# Altium schematic sheet Copy of HV_PWR_STAGE.SchDoc: Stabilizer
size 420 x 297 mm; EDA_Number: ARTIQ; Projet: Sampler; Author: G.Kasprowicz; CompanyName: WUT ISE; DrawnBy: G.Kasprowicz; Organization: WUT ISE; Address1: PW ISE; Address2: Nowowiejska 15/19 00-665 Warsaw; Address3: gkasprow@gmail.com; DocumentNumber: 8; Revision: 1.0; SheetNumber: 8; SheetTotal: 11; ModifiedBy: -; CheckedDate: -; Title2: ADC; DivGrp: WUT ISE; Designer: G.Kasprowicz; ModifiedDate: -; ProjectName: Sensor Box
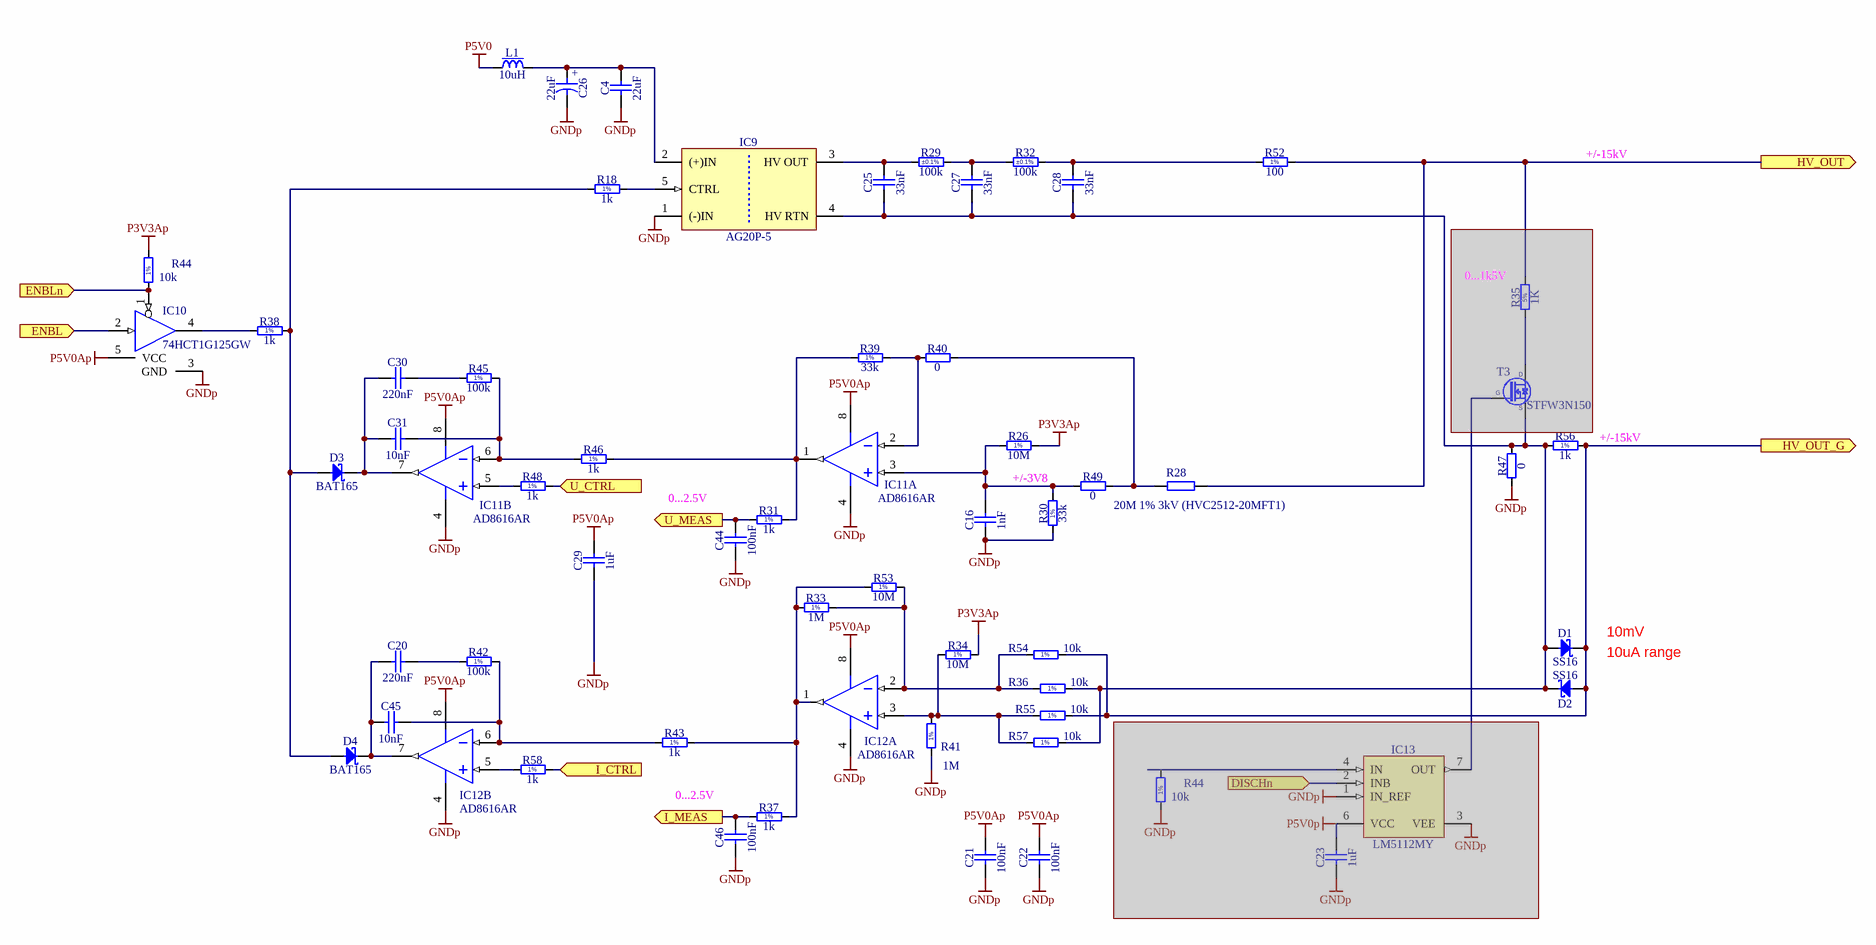
[diagram p0: Copy of HV_PWR_STAGE.SchDoc]

## Parts
(Parts that share a designator on the sheet are numbered #1, #2 ... from top to bottom, then left to right.)
C4  22uF  [CAPC3216X180N]
C16  1nF  [CAPC1005X55N]
C20  220nF  [CAPC1608X87N]
C21  100nF  [CAPC1005X55N]
C22  100nF  [CAPC1005X55N]
C23  1uF  [CAPC1608X87N]  (masked out: inside a compile mask, not in the netlist)
C25  33nF  [CAPC5764X279N]
C26  22uF  [CAPMP3528X210N]
C27  33nF  [CAPC5764X279N]
C28  33nF  [CAPC5764X279N]
C29  1uF  [CAPC1608X87N]
C30  220nF  [CAPC1608X87N]
C31  10nF  [CAPC1608X87N]
C44  100nF  [CAPC1005X55N]
C45  10nF  [CAPC1608X87N]
C46  100nF  [CAPC1005X55N]
D1  SS16  [DIOM5127X229N]
D2  SS16  [DIOM5127X229N]
D3  BAT165  [SOD2512X110N]
D4  BAT165  [SOD2512X110N]
IC9  AG20P-5  [DCDC_XPPOWER_AG0-2KV]
IC10  74HCT1G125GW  [SOT65P210X110-5N]
IC11  AD8616AR  [ADI-R-8_N]  (parts A,B of 2)
IC12  AD8616AR  [ADI-R-8_N]  (parts A,B of 2)
IC13  LM5112MY  [SOP65P490X110-9N-R190X200]  (masked out: inside a compile mask, not in the netlist)
L1  10uH  [IND_BOURNS_PM43]
R18  1k  [RESC1608X55N]
R26  10M  [RESC1508X63N]
R28  20M 1% 3kV (HVC2512-20MFT1)  [2512]
R29  100k  Tolerance: ±0.1%  [RESC3216X50N]
R30  33k  [RESC1005X40N]
R31  1k  [RESC1005X40N]
R32  100k  Tolerance: ±0.1%  [RESC3216X50N]
R33  1M  [RESC1005X40N]
R34  10M  [RESC1508X63N]
R35  1K  [RES_OHMITE_MC102]  (masked out: inside a compile mask, not in the netlist)
R36  10k  [RESC1005X40N]
R37  1k  [RESC1005X40N]
R38  1k  [RESC1005X40N]
R39  33k  [RESC1005X40N]
R40  0  [RESC1005X40N]
R41  1M  [RESC1005X40N]
R42  100k  [RESC1608X55N]
R43  1k  [RESC1005X40N]
R44#1  10k  [RESC1005X40N]
R44#2  10k  [RESC1005X40N]  (masked out: inside a compile mask, not in the netlist)
R45  100k  [RESC1608X55N]
R46  1k  [RESC1005X40N]
R47  0  [RESC1005X40N]
R48  1k  [RESC1005X40N]
R49  0  [RESC1005X40N]
R52  100  [RESC6331X70N]
R53  10M  [RESC1508X63N]
R54  10k  [RESC1005X40N]
R55  10k  [RESC1005X40N]
R56  1k  [RESC1005X40N]
R57  10k  [RESC1005X40N]
R58  1k  [RESC1005X40N]
T3  STFW3N150  [INFINEON_PG-TO-220 FP-h]  (masked out: inside a compile mask, not in the netlist)

## Ports
DISCHn (in), ENBL (in), ENBLn (in), HV_OUT (out), HV_OUT_G (out), I_CTRL (in), I_MEAS (out), U_CTRL (in), U_MEAS (out)

## Nets
GNDp: C4.1 C16.1 C21.1 C22.1 C26.2 C29.1 C44.1 C46.1 IC9.1((-)IN) IC10.3(GND) IC11.4(-V) IC12.4(-V) R30.1 R41.1 R47.1
P3V3Ap: R26.2 R34.2 R44#1.2
P5V0: L1.1
P5V0Ap: C21.2 C22.2 C29.2 IC10.5(VCC) IC11.8(+V) IC12.8(+V)
ENBL: IC10.2(IN) ; port ENBL
ENBLn: IC10.1(~{G}) R44#1.1 ; port ENBLn
HV_OUT: R28.2 R52.2 ; port HV_OUT
HV_OUT_G: D1.1(C) D2.2(A) R54.2 R55.2 R56.2 ; port HV_OUT_G
I_CTRL: R58.2 ; port I_CTRL
I_MEAS: C46.2 R37.1 ; port I_MEAS
U_CTRL: R48.2 ; port U_CTRL
U_MEAS: C44.2 R31.1 ; port U_MEAS
NetC4_2: C4.2 C26.1 IC9.2((+)IN) L1.2
NetC16_2: C16.2 IC11.3(+IN_A) R26.1 R30.2 R49.1
NetC20_1: C20.1 C45.1 D4.1(C) IC12.7(OUT_B)
NetC20_2: C20.2 R42.1
NetC25_1: C25.1 C27.1 C28.1 D1.2(A) D2.1(C) IC9.4(HV_RTN) R36.2 R47.2 R56.1 R57.2
NetC25_2: C25.2 IC9.3(HV_OUT) R29.1
NetC27_2: C27.2 R29.2 R32.1
NetC28_2: C28.2 R32.2 R52.1
NetC30_1: C30.1 C31.1 D3.1(C) IC11.7(OUT_B)
NetC30_2: C30.2 R45.1
NetC31_2: C31.2 IC11.6(-IN_B) R45.2 R46.1
NetC45_2: C45.2 IC12.6(-IN_B) R42.2 R43.1
NetD3_2: D3.2(A) D4.2(A) R18.1 R38.2
NetIC9_5: IC9.5(CTRL) R18.2
NetIC10_4: IC10.4(OUT) R38.1
NetIC11_1: IC11.1(OUT_A) R31.2 R39.1 R46.2
NetIC11_2: IC11.2(-IN_A) R39.2 R40.1
NetIC11_5: IC11.5(+IN_B) R48.1
NetIC12_1: IC12.1(OUT_A) R33.1 R37.2 R43.2 R53.1
NetIC12_2: IC12.2(-IN_A) R33.2 R36.1 R53.2 R54.1
NetIC12_3: IC12.3(+IN_A) R34.1 R41.2 R55.1 R57.1
NetIC12_5: IC12.5(+IN_B) R58.1
NetR28_1: R28.1 R40.2 R49.2

## Notes on the sheet
- +/-15kV
- (near R35) 0...1k5V
- +/-3V8
- (near R56) +/-15kV
- 0...2.5V
- 10uA range
- (near D1) 10mV
- Project/Equipment
- Document
- Designer
- Drawn by
- Check.by
- Copyright WUT ISE 2018.
  This documentation describes Open Hardware and is licensed under the CERN OHL v.1.1. You may redistribute and modify this documentation under the terms of the CERN OHL v.1.1. (http://ohwr.org/CERNOHL). This documentation is distributed WITHOUT ANY EXPRESS OR IMPLIED WARRANTY, INCLUDING OF MERCHANTABILITY, SATISFACTORY QUALITY AND FITNESS FOR A PARTICULAR PURPOSE. Please see the CERN OHL v.1.1 for applicable conditions.
- Contact
- File
- Last Mod.
- Print Date
- Sheet
- Size
- A3
- of
- Rev
- (in symbol CTE3528-21_22UF_20V_10%) +
- (in symbol R0402_1K_1%_0.0625W_100PPM) 1%
- (in symbol R0402_1M_1%_0.0625W_100PPM) 1%
- (in symbol R0402_10K_1%_0.0625W_100PPM) 1%
- (in symbol R0402_33K_1%_0.0625W_100PPM) 1%
- (in symbol R0603_1K_1%_0.1W_100PPM) 1%
- (in symbol R0603_10M_1%_0.125W_100PPM_VISHAY_CHP) 1%
- (in symbol R0603_100K_1%_0.1W_100PPM) 1%
- (in symbol R2512_100R_1%_1.5W_100PPM_VISHAY_CRCW-HP e3) 1%
- (in symbol R5025_1K_5%_1W_50PPM_OHMITE_MC102) 5%

## Library data of the parts
C4 = CC1206_22UF_25V_20%_X5R: Non-polarised capacitor; Part Description: SMD Multilayer Chip Ceramic Capacitor; Manufacturer: GENERIC; Manufacturer1 Part Number: C3216X5R1E226M160AB; Voltage: 25V; TC: X5R; Tolerance: ±20%; Part Number: CC1206_22UF_25V_20%_X5R; Component Kind: Standard; Component Type: Standard; Pin Count: 2; Value: 22uF; Status: None; Manufacturer Part Number: CC1206_22UF_25V_20%_X5R; Case: 1206; Mounted: Yes; Socket: No; SMD: Yes; Sense: No; Manufacturer1 Example: TDK; Manufacturer1 ComponentHeight: 1.8mm; HelpURL: \\cern.ch\dfs\Applications\Altium\Datasheets\CC1206_X5R_TDK_C.pdf; Author: CERN DEM WB; CreateDate: 25/07/2018; LatestRevisionDate: 25/07/2018
C16 = CC0402_1NF_50V_10%_X7R: Non-polarised capacitor; Part Description: SMD Multilayer Chip Ceramic Capacitor; Manufacturer: GENERIC; Manufacturer1 Part Number: 223858715623; Voltage: 50V; TC: X7R; Tolerance: ±10%; Part Number: CC0402_1NF_50V_10%_X7R; Component Kind: Standard; Component Type: Standard; Pin Count: 2; Value: 1nF; Status: Not Recommended; Manufacturer Part Number: CC0402_1NF_50V_10%_X7R; Case: 0402; Mounted: Yes; Socket: No; SMD: Yes; Sense: No; Manufacturer1 Example: PHYCOMP; Manufacturer1 ComponentHeight: 0.55mm; HelpURL: \\cern.ch\dfs\Applications\Altium\Datasheets\CC0402_X7R_PHYCOMP.pdf; Author: CERN DEM JLC; CreateDate: 2007-12-03; LatestRevisionDate: 2007-12-03
C20 C30 = CC0603_220NF_10V_10%_X7R: Non-polarised capacitor; Part Description: SMD Multilayer Chip Ceramic Capacitor; Manufacturer: GENERIC; Manufacturer1 Part Number: 223824615654 or CC0603KRX7R6BB224; Voltage: 10V; TC: X7R; Tolerance: ±10%; Part Number: CC0603_220NF_10V_10%_X7R; Component Kind: Standard; Component Type: Standard; Pin Count: 2; Value: 220nF; Status: Preferred; Manufacturer Part Number: CC0603_220NF_10V_10%_X7R; Case: 0603; Mounted: Yes; Socket: No; SMD: Yes; Sense: No; Manufacturer1 Example: YAGEO PHYCOMP; Manufacturer1 ComponentHeight: 0.9mm; HelpURL: \\cern.ch\dfs\Applications\Altium\Datasheets\CC0603_X7R_PHYCOMP.pdf; Author: CERN DEM JLC; CreateDate: 2012-10-25; LatestRevisionDate: 2012-10-25
C21 C22 C44 C46 = CC0402_100NF_16V_10%_X7R: Non-polarised capacitor; Part Description: SMD Multilayer Chip Ceramic Capacitor; Manufacturer: GENERIC; Manufacturer1 Part Number: GRM155R71C104KA88D; Voltage: 16V; TC: X7R; Tolerance: ±10%; Part Number: CC0402_100NF_16V_10%_X7R; Component Kind: Standard; Component Type: Standard; Pin Count: 2; Value: 100nF; Status: Not Recommended; Manufacturer Part Number: CC0402_100NF_16V_10%_X7R; Case: 0402; Mounted: Yes; Socket: No; SMD: Yes; Sense: No; Manufacturer1 Example: MURATA; Manufacturer1 ComponentHeight: 0.55mm; HelpURL: \\cern.ch\dfs\Applications\Altium\Datasheets\CC0402_X7R_MURATA_GRM.pdf; Author: CERN DEM JLC; CreateDate: 2013-12-05; LatestRevisionDate: 2007-12-03
C23 C29 = CC0603_1UF_25V_10%_X7R: Non-polarised capacitor; Part Description: SMD Multilayer Chip Ceramic Capacitor; Manufacturer: GENERIC; Manufacturer1 Part Number: GRM188R71E105KA12D; Voltage: 25V; TC: X7R; Tolerance: ±10%; Part Number: CC0603_1UF_25V_10%_X7R; Component Kind: Standard; Component Type: Standard; Pin Count: 2; Value: 1uF; Status: None; Manufacturer Part Number: CC0603_1UF_25V_10%_X7R; Case: 0603; Mounted: Yes; Socket: No; SMD: Yes; Sense: No; Manufacturer1 Example: MURATA; Manufacturer1 ComponentHeight: 0.9mm; HelpURL: \\cern.ch\dfs\Applications\Altium\Datasheets\CC0603_X7R_MURATA.pdf; Author: CERN DEM JLC
  C23: CreateDate: 2011-01-18; LatestRevisionDate: 2011-01-18
  C29: CreateDate: 18/01/2011; LatestRevisionDate: 18/01/2011
C25 C27 C28 = CC2225_33NF_2KV_10%_X7R: Non-polarised capacitor; Part Description: High Voltage MLC Chip Capacitor; Manufacturer: GENERIC; Manufacturer1 Part Number: 2225GC333KAT1A; Voltage: 2KV; TC: X7R; Tolerance: ±10%; Part Number: CC2225_33NF_2KV_10%_X7R; Component Kind: Standard; Component Type: Standard; Pin Count: 2; Value: 33nF; Status: None; Manufacturer Part Number: CC2225_33NF_2KV_10%_X7R; Case: 2225; Mounted: Yes; Socket: No; SMD: Yes; Sense: No; Manufacturer1 Example: AVX; Manufacturer1 ComponentHeight: 2.54mm; HelpURL: \\cern.ch\dfs\Applications\Altium\Datasheets\CC2225_X7R_AVX_HV-MLC.pdf; Author: CERN DEM JMW; CreateDate: 13.07.2015; LatestRevisionDate: 13.07.2015
C26 = CTE3528-21_22UF_20V_10%: Polarised capacitor; Part Description: Solid Tantalum Chip Capacitor; Manufacturer: GENERIC; Manufacturer1 Part Number: TAJB226K020R; Voltage: 20V; Tolerance: ±10%; Part Number: CTE3528-21_22UF_20V_10%; Component Kind: Standard; Component Type: Standard; Pin Count: 2; Value: 22uF; Status: Preferred; Manufacturer Part Number: CTE3528-21_22UF_20V_10%; Case: B; Mounted: Yes; Socket: No; SMD: Yes; Sense: No; Manufacturer1 Example: AVX; Manufacturer1 ComponentHeight: 2.1mm; HelpURL: \\cern.ch\dfs\Applications\Altium\Datasheets\CTE_AVX_TAJ.pdf; Author: CERN DEM JLC; CreateDate: 03/12/2007; LatestRevisionDate: 03/12/2007
C31 C45 = CC0603_10NF_50V_5%_C0G: Non-polarised capacitor; Part Description: SMD Multilayer Chip Ceramic Capacitor; Manufacturer: GENERIC; Manufacturer1 Part Number: C1608C0G1H103J080AA; Voltage: 50V; TC: C0G/NP0; Tolerance: ±5%; Part Number: CC0603_10NF_50V_5%_C0G; Component Kind: Standard; Component Type: Standard; Pin Count: 2; Value: 10nF; Status: Preferred; Manufacturer Part Number: CC0603_10NF_50V_5%_C0G; Case: 0603; Mounted: Yes; Socket: No; SMD: Yes; Sense: No; Manufacturer1 Example: TDK; Manufacturer1 ComponentHeight: 0.9mm; HelpURL: \\cern.ch\dfs\Applications\Altium\Datasheets\CC0603_C0G_TDK_C.pdf; Author: CERN DEM JLC; CreateDate: 2014-12-10; LatestRevisionDate: 2014-12-10
D1 D2 = SS16: Schottky Diode; Part Description: Surface Mount Schottky Barrier Rectifier; Manufacturer: VISHAY GENERAL SEMICONDUCTOR; Voltage: 60V; Power: 1A; PressFit: No; Bonding: No; Part Number: SS16; Component Kind: Standard; Component Type: Standard; Device: SS16; PackageDescription: DO-214-AC Molded Diode, Body 5.1x2.7mm, IPC Medium Density; Manufacturer Part Number: SS16; Pin Count: 2; Case: DO-214AC; Mounted: Yes; Socket: No; SMD: Yes; Sense: No; ComponentHeight: 2.29mm; HelpURL: \\cern.ch\dfs\Applications\Altium\Datasheets\SS16.pdf; Author: CERN DEM JLC; CreateDate: 2008-07-15; LatestRevisionDate: 2010-08-23
D3 D4 = BAT165: Schottky Diode; Part Description: Medium Power AF Schottky Diode; Manufacturer: INFINEON; Voltage: 40V; Power: 750mA; PressFit: No; Bonding: No; Part Number: BAT165; Component Kind: Standard; Component Type: Standard; Device: BAT165; PackageDescription: Small Outline Diode (SOD-323), 1.70mm W X 1.25mm L X 1.10mm H body,  IPC Medium Density; Manufacturer Part Number: BAT165; Pin Count: 2; Case: SOD-323; Mounted: Yes; Socket: No; SMD: Yes; Sense: No; ComponentHeight: 1.1mm; HelpURL: \\cern.ch\dfs\Applications\Altium\Datasheets\BAT165.pdf; Author: CERN DEM JLC; CreateDate: 12.11.2014; LatestRevisionDate: 12.11.2014
IC9 = AG20P-5: XP POWER, AG Series, DC/HVDC Converter; Part Description: 5VDC to 0-2kVDC, Iout (max) 0.5mA, 1W DC-HVDC Converter; PressFit: No; Bonding: No; Part Number: AG20P-5; Component Kind: Standard; Component Type: Standard; Device: AG20P-5; PackageDescription: AG Series, DC/HVDC Converter, Body W 11.43mm x L 23.37mm x H 6.35mm; Manufacturer: XP POWER; Manufacturer Part Number: AG20P-5; Pin Count: 5; Mounted: Yes; Socket: No; SMD: Yes; Sense: No; ComponentHeight: 3.3mm; HelpURL: \\cern.ch\dfs\Applications\Altium\Datasheets\XPPOWER_AG-Series.pdf; Author: CERN DEM BC; CreateDate: 18.09.2020; LatestRevisionDate: 18.09.2020
IC10 = 74HCT1G125GW: Single Bus Buffer Gate With 3-State Output; Part Description: Bus Buffer/Line Driver 3-State; Manufacturer: NEXPERIA; PressFit: No; Bonding: No; Part Number: 74HCT1G125GW; Component Kind: Standard; Component Type: Standard; Device: 74HCT1G125GW; PackageDescription: SOT353, SC70-5, 0.65mm Pitch; 5 Pin, 1.25mm W X 2.00mm L X 1.10mm H body, IPC Medium Density; Manufacturer Part Number: 74HCT1G125GW; Pin Count: 5; Case: SOT353; Mounted: Yes; Socket: No; SMD: Yes; Sense: No; ComponentHeight: 1.1mm; Author: CERN DEM JMW; HelpURL: \\cern.ch\dfs\Applications\Altium\Datasheets\74HCT1G125GW.pdf; CreateDate: 06.08.2020; LatestRevisionDate: 06.08.2020
IC11 IC12 = CMP-0384-00615-1: Double Channel Wide Bandwidth Operational Amplifier, 24 MHz BW, 12 V/us SR, Industrial, 8-pin SOIC (R-8), Tube; Manufacturer: Analog Devices; Generic Part Number: AD8616; Input Bias Current: 200fA; Amplifiers Per Package: 2; V Span Min: 2.7V; Input Offset Voltage: 23uV; V Span Max: 6V; Small Signal Bandwidth: 24MHz; Slew Rate: 12V/us; Iq/Amp: 2mA; ComponentLink3Description: Package Specification; ComponentLink3URL: http://www.analog.com/static/imported-files/packages/PKG_PDF/SOIC_Narrow%20(R)/R_8.pdf; ComponentLink2URL: http://www.analog.com/static/imported-files/data_sheets/AD8615_8616_8618.pdf; PackageVersion: 060506-A; Mounting Technology: Surface Mount; Code_JEDEC: MS-012-AA; PackageDescription: 8-Pin Standard Small Outline Package, Body 3.9 x 4.9 mm, Pitch 1.27 mm; ComponentLink1Description: Manufacturer URL; PartNumber: AD8616AR; ComponentLink1URL: http://www.analog.com/en/index.html; DatasheetVersion: Rev. E; PackageReference: R-8; ComponentLink2Description: Datasheet
IC13 = LM5112MY: Tiny 7A MOSFET Gate Driver; Manufacturer: NATIONAL SEMICONDUCTOR; PressFit: No; Bonding: No; Part Number: LM5112MY; Component Kind: Standard; Component Type: Standard; Device: LM5112MY; PackageDescription: SOP, 0.65mm Pitch; 8 Pin, 3.00mm W X 3.00mm L X 1.10mm H body (w/Thermal Tab 1.90 X 2.00mm), IPC Medium Density; Part Description: Tiny 7A MOSFET Gate Driver; Manufacturer Part Number: LM5112MY; Pin Count: 8; Case: MSOP8; Mounted: Yes; Socket: No; SMD: Yes; Sense: No; ComponentHeight: 1.1mm; Author: CERN DEM JLC; HelpURL: \\cern.ch\dfs\Applications\Altium\Datasheets\LM5112MY.pdf; CreateDate: 25.11.2008; LatestRevisionDate: 27.03.2019
L1 = IND_10UH_20%_BOURNS_PM43: Inductor With Core; Part Description: SMD Power Inductor; Manufacturer: BOURNS; Manufacturer Part Number: PM43-100M-RC; Power: 1.15A; Resistance: 0.18R; Tolerance: ±20%; Part Number: IND_10UH_20%_BOURNS_PM43; Component Kind: Standard; Component Type: Standard; Pin Count: 2; Value: 10uH; Status: None; Mounted: Yes; Socket: No; SMD: Yes; Sense: No; ComponentHeight: 3.5mm; HelpURL: \\cern.ch\dfs\Applications\Altium\Datasheets\IND_BOURNS_PM43.pdf; Author: CERN DEM JLC; CreateDate: 17/05/2011; LatestRevisionDate: 17/05/2011
R18 = R0603_1K_1%_0.1W_100PPM: Resistor - 1%; Part Description: General Purpose Thick Film Chip Resistor; Manufacturer: GENERIC; Manufacturer1 Part Number: NRC06F1001TRF; Power: 0.1W; TC: ±100ppm/°C; PressFit: No; Part Number: R0603_1K_1%_0.1W_100PPM; Component Kind: Standard; Component Type: Standard; Pin Count: 2; Value: 1k; Status: Preferred; Tolerance: ±1%; Manufacturer Part Number: R0603_1K_1%_0.1W_100PPM; Case: 0603; Mounted: Yes; Sense: No; Socket: No; SMD: Yes; Manufacturer1 Example: NIC COMPONENT; Manufacturer1 ComponentHeight: 0.55mm; HelpURL: \\cern.ch\dfs\Applications\Altium\Datasheets\R0603_NIC_NRC.pdf; Author: CERN DEM JLC; CreateDate: 03/12/2007; LatestRevisionDate: 13/03/2008
R26 R34 R53 = R0603_10M_1%_0.125W_100PPM_VISHAY_CHP: Resistor - 1%; Part Description: High Stability Metal Glaze Thick Film Chip Resistor; Manufacturer: VISHAY SFERNICE; Manufacturer Part Number: CHP0603K1005FNT; Power: 0.125W; TC: ±100ppm/°C; Part Number: R0603_10M_1%_0.125W_100PPM_VISHAY_CHP; Component Kind: Standard; Component Type: Standard; Pin Count: 2; Value: 10M; Status: None; Tolerance: ±1%; Case: 0603; Mounted: Yes; Sense: No; Socket: No; SMD: Yes; ComponentHeight: 0.63mm; HelpURL: \\cern.ch\dfs\Applications\Altium\Datasheets\R0603_VISHAY_CHP.pdf; Author: CERN DEM JLC; CreateDate: 2011-06-22; LatestRevisionDate: 2011-06-22
R28 = RES_SMD_POW: 1W SMD Resistor (TME)
R29 R32 = R1206_100K_0.1%_0.4W_25PPM_VISHAY_PAT: Resistor - 0.1%; Part Description: Precision Automotive Thin Film Chip Resistors 2kV ESD Rating; Manufacturer: VISHAY DALE THIN FILM; Manufacturer Part Number: PAT1206E1003BS; Power: 0.4W; TC: ±25ppm/°C; PressFit: No; Part Number: R1206_100K_0.1%_0.4W_25PPM_VISHAY_PAT; Component Kind: Standard; Component Type: Standard; Pin Count: 2; Value: 100k; Status: None; Case: 1206; Mounted: Yes; Sense: No; Socket: No; SMD: Yes; ComponentHeight: 0.5mm; HelpURL: \\cern.ch\dfs\Applications\Altium\Datasheets\R1206_VISHAY_PAT.pdf; Author: CERN DEM MR; CreateDate: 19.07.2016; LatestRevisionDate: 19.07.2016
R30 R39 = R0402_33K_1%_0.0625W_100PPM: Resistor - 1%; Part Description: General Purpose Thick Film Chip Resistor; Manufacturer: GENERIC; Manufacturer1 Part Number: 232270673303L; TC: ±100ppm/°C; Part Number: R0402_33K_1%_0.0625W_100PPM; Component Kind: Standard; Component Type: Standard; Pin Count: 2; Value: 33k; Status: Not recommended; Power: 0.0625W; Tolerance: ±1%; Manufacturer Part Number: R0402_33K_1%_0.0625W_100PPM; Case: 0402; Mounted: Yes; Sense: No; Socket: No; SMD: Yes; Manufacturer1 Example: YAGEO PHYCOMP; Manufacturer1 ComponentHeight: 0.4mm; HelpURL: \\cern.ch\dfs\Applications\Altium\Datasheets\R0402_Phycomp_RC0402.pdf; Author: CERN DEM JLC; CreateDate: 2007-12-03; LatestRevisionDate: 2012-10-17
R31 R37 R38 R43 R46 R48 R56 R58 = R0402_1K_1%_0.0625W_100PPM: Resistor - 1%; Part Description: General Purpose Thick Film Chip Resistor; Manufacturer: GENERIC; Manufacturer1 Part Number: 232270671002L; TC: ±100ppm/°C; Part Number: R0402_1K_1%_0.0625W_100PPM; Component Kind: Standard; Component Type: Standard; Pin Count: 2; Value: 1k; Status: Not recommended; Power: 0.0625W; Tolerance: ±1%; Manufacturer Part Number: R0402_1K_1%_0.0625W_100PPM; Case: 0402; Mounted: Yes; Sense: No; Socket: No; SMD: Yes; Manufacturer1 Example: YAGEO PHYCOMP; Manufacturer1 ComponentHeight: 0.4mm; HelpURL: \\cern.ch\dfs\Applications\Altium\Datasheets\R0402_Phycomp_RC0402.pdf; Author: CERN DEM JLC; CreateDate: 2007-12-03; LatestRevisionDate: 2012-10-17
R33 R41 = R0402_1M_1%_0.0625W_100PPM: Resistor - 1%; Part Description: General Purpose Thick Film Chip Resistor; Manufacturer: GENERIC; Manufacturer1 Part Number: 232270671005L; TC: ±100ppm/°C; Part Number: R0402_1M_1%_0.0625W_100PPM; Component Kind: Standard; Component Type: Standard; Pin Count: 2; Value: 1M; Status: Not recommended; Power: 0.0625W; Tolerance: ±1%; Manufacturer Part Number: R0402_1M_1%_0.0625W_100PPM; Case: 0402; Mounted: Yes; Sense: No; Socket: No; SMD: Yes; Manufacturer1 Example: YAGEO PHYCOMP; Manufacturer1 ComponentHeight: 0.4mm; HelpURL: \\cern.ch\dfs\Applications\Altium\Datasheets\R0402_Phycomp_RC0402.pdf; Author: CERN DEM JLC; CreateDate: 2007-12-03; LatestRevisionDate: 2012-10-17
R35 = R5025_1K_5%_1W_50PPM_OHMITE_MC102: Resistor - 5%; Part Description: 5kV High Voltage Precision Thick Film Resistor; Manufacturer: OHMITE; Manufacturer Part Number: MC102821001JE; Power: 1.5W; TC: ±50ppm/°C; Voltage: 5000V; PressFit: No; Part Number: R5025_1K_5%_1W_50PPM_OHMITE_MC102; Component Kind: Standard; Component Type: Standard; Pin Count: 2; Value: 1K; Status: None; Tolerance: ±5%; Case: 5025; Mounted: Yes; Sense: No; Socket: No; SMD: Yes; ComponentHeight: 0.89mm; HelpURL: \\cern.ch\dfs\Applications\Altium\Datasheets\R5025_OHMITE_MC102.pdf; Author: CERN DEM MR; CreateDate: 12.07.2019; LatestRevisionDate: 25.08.2020
R36 R44#1 R44#2 R54 R55 R57 = R0402_10K_1%_0.0625W_100PPM: Resistor - 1%; Part Description: General Purpose Thick Film Chip Resistor; Manufacturer: GENERIC; Manufacturer1 Part Number: 232270671003L; TC: ±100ppm/°C; Part Number: R0402_10K_1%_0.0625W_100PPM; Component Kind: Standard; Component Type: Standard; Pin Count: 2; Value: 10k; Status: Not recommended; Power: 0.0625W; Tolerance: ±1%; Manufacturer Part Number: R0402_10K_1%_0.0625W_100PPM; Case: 0402; Mounted: Yes; Sense: No; Socket: No; SMD: Yes; Manufacturer1 Example: YAGEO PHYCOMP; Manufacturer1 ComponentHeight: 0.4mm; HelpURL: \\cern.ch\dfs\Applications\Altium\Datasheets\R0402_Phycomp_RC0402.pdf; Author: CERN DEM JLC; CreateDate: 2007-12-03; LatestRevisionDate: 2012-10-17
R40 R49 = R0402_0R_JUMPER: Resistor; Part Description: 1A (0.05R Max DC Resistance) Zero Ohm Jumper; Manufacturer: GENERIC; Manufacturer1 Part Number: 232270591001L; PressFit: No; Part Number: R0402_0R_JUMPER; Component Kind: Standard; Component Type: Standard; Pin Count: 2; Value: 0; Status: Not Recommended; Manufacturer Part Number: R0402_0R_JUMPER; Case: 0402; Mounted: Yes; Sense: No; Socket: No; SMD: Yes; Manufacturer1 Example: YAGEO PHYCOMP; Manufacturer1 ComponentHeight: 0.4mm; HelpURL: \\cern.ch\dfs\Applications\Altium\Datasheets\R0402_Phycomp_RC0402.pdf; Author: CERN DEM JLC; CreateDate: 03.12.2007; LatestRevisionDate: 17.10.2012
R42 R45 = R0603_100K_1%_0.1W_100PPM: Resistor - 1%; Part Description: General Purpose Thick Film Chip Resistor; Manufacturer: GENERIC; Manufacturer1 Part Number: NRC06F1003TRF; Power: 0.1W; TC: ±100ppm/°C; Part Number: R0603_100K_1%_0.1W_100PPM; Component Kind: Standard; Component Type: Standard; Pin Count: 2; Value: 100k; Status: Preferred; Tolerance: ±1%; Manufacturer Part Number: R0603_100K_1%_0.1W_100PPM; Case: 0603; Mounted: Yes; Sense: No; Socket: No; SMD: Yes; Manufacturer1 Example: NIC COMPONENT; Manufacturer1 ComponentHeight: 0.55mm; HelpURL: \\cern.ch\dfs\Applications\Altium\Datasheets\R0603_NIC_NRC.pdf; Author: CERN DEM JLC; CreateDate: 2007-12-03; LatestRevisionDate: 2008-03-13
R47 = R0402_0R_JUMPER: Resistor; Part Description: 1A (0.05R Max DC Resistance) Zero Ohm Jumper; Manufacturer: GENERIC; Manufacturer1 Part Number: 232270591001L; Part Number: R0402_0R_JUMPER; Component Kind: Standard; Component Type: Standard; Pin Count: 2; Value: 0; Status: Not recommended; Manufacturer Part Number: R0402_0R_JUMPER; Case: 0402; Mounted: Yes; Sense: No; Socket: No; SMD: Yes; Manufacturer1 Example: YAGEO PHYCOMP; Manufacturer1 ComponentHeight: 0.4mm; HelpURL: \\cern.ch\dfs\Applications\Altium\Datasheets\R0402_Phycomp_RC0402.pdf; Author: CERN DEM JLC; CreateDate: 2007-12-03; LatestRevisionDate: 2012-10-17
R52 = R2512_100R_1%_1.5W_100PPM_VISHAY_CRCW-HP e3: Resistor - 1%; Part Description: Pulse Proof, High Power Thick Film Chip Resistor; Manufacturer: VISHAY DRALORIC; Manufacturer Part Number: CRCW2512100RFKEHHP; Power: 1.5W; TC: ±100ppm/°C; Voltage: 500V; Part Number: R2512_100R_1%_1.5W_100PPM_VISHAY_CRCW-HP e3; Component Kind: Standard; Component Type: Standard; Pin Count: 2; Value: 100; Status: None; Tolerance: ±1%; Case: 2512; Mounted: Yes; Sense: No; Socket: No; SMD: Yes; ComponentHeight: 0.7mm; HelpURL: \\cern.ch\dfs\Applications\Altium\Datasheets\R2512_VISHAY_CRCW-HP e3.pdf; Author: CERN DEM JLC; CreateDate: 2013-05-21; LatestRevisionDate: 2013-05-21
T3 = Q_STP4N150: N-CHANNEL MOSFET  1.5kV 4A, 160W; Part Description: 1500V 3A N-Channel  Power Transistor; Manufacturer: ST MICROELECTRONICS; PressFit: No; Bonding: No; Part Number: STFW3N150; Component Kind: Standard; Component Type: Standard; Device: STFW3N150; PackageDescription: TO-220 3-Terminal Outline/Fully Isolated package (2500VAC; 1minute) - Horizontal Mount; Manufacturer Part Number: STFW3N150; Pin Count: 3; Case: TO-220; Mounted: Yes; Socket: No; SMD: No; Sense: No; ComponentHeight: 4.85mm; HelpURL: \\cern.ch\dfs\Applications\Altium\Datasheets\IPA90R340C3.pdf; Author: GK; CreateDate: 2016-05-28; LatestRevisionDate: 2014-10-20